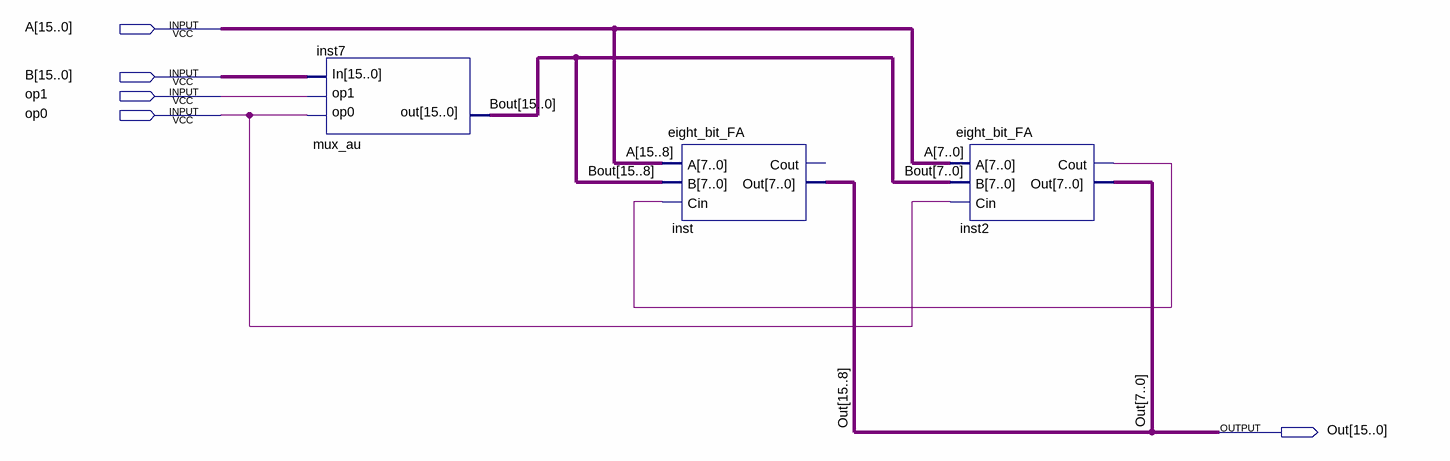
[diagram p0: schematic sheet]
// Quartus schematic au.bdf as structural Verilog: 3 symbols, 5 pins
module au (
  input  [15:0] A,
  input  [15:0] B,
  input  op1,
  input  op0,
  output [15:0] Out
);

  wire inst2_cout;
  wire [15:0] Bout;

  mux_au inst7 (.op0(op0), .op1(op1), .In(B), .out(Bout));
  eight_bit_FA inst (.A(A[15:8]), .B(Bout[15:8]), .Cin(inst2_cout), .Out(Out[15:8]));  // open: Cout
  eight_bit_FA inst2 (.A(A[7:0]), .B(Bout[7:0]), .Cin(op0), .Cout(inst2_cout), .Out(Out[7:0]));
endmodule
